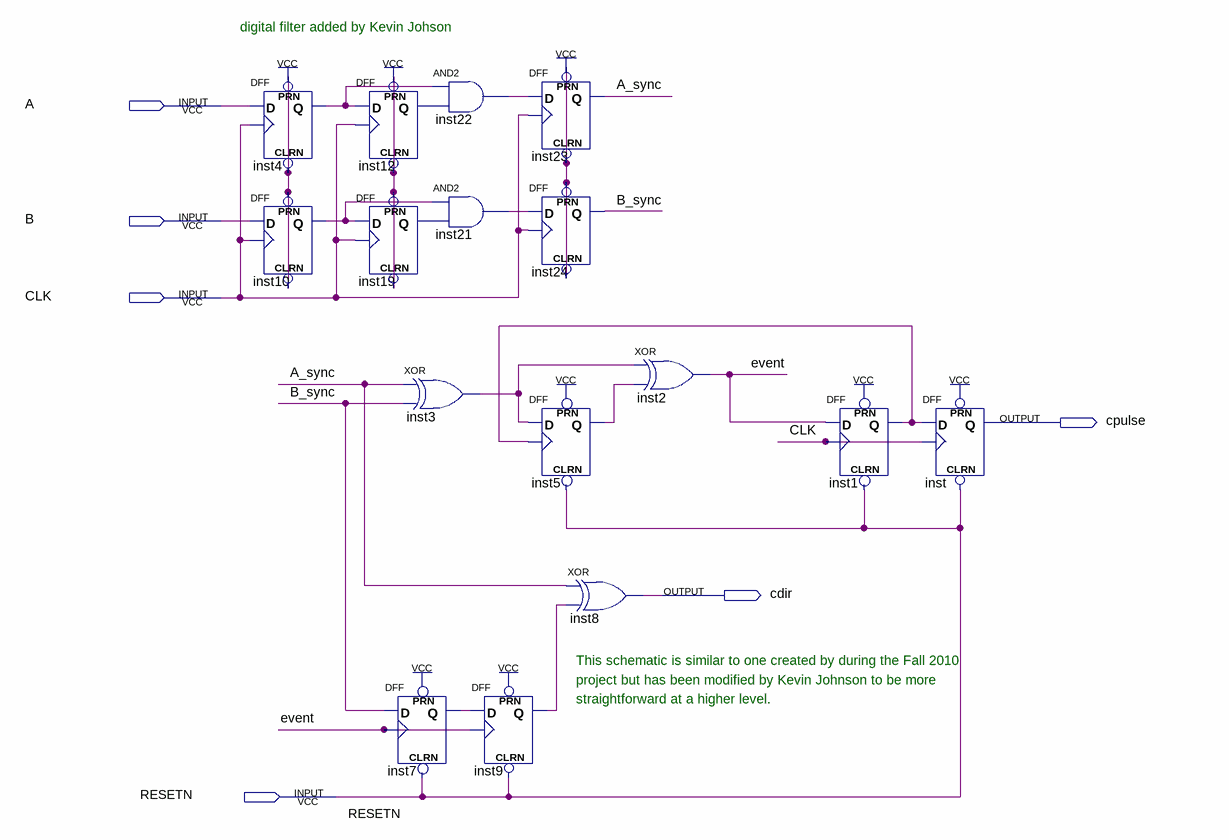
[diagram p0: schematic sheet]
// Quartus schematic QUADRATURE_DECODE.bdf as structural Verilog: 16 symbols, 6 pins
module QUADRATURE_DECODE (
  input  A,
  input  B,
  input  CLK,
  input  RESETN,
  output cpulse,
  output cdir
);

  wire A_sync, B_sync, \event , inst1_q, inst3_out, inst4_q, inst5_q, inst7_q, inst9_q, inst10_q, inst12_q,
       inst19_q, inst21_out, inst22_out;

  DFF inst4 (.CLRN(1'b1), .CLK(CLK), .D(A), .PRN(1'b1), .Q(inst4_q));
  DFF inst10 (.CLRN(1'b1), .CLK(CLK), .D(B), .PRN(1'b1), .Q(inst10_q));
  DFF inst12 (.CLRN(1'b1), .CLK(CLK), .D(inst4_q), .PRN(1'b1), .Q(inst12_q));
  DFF inst19 (.CLRN(1'b1), .CLK(CLK), .D(inst10_q), .PRN(1'b1), .Q(inst19_q));
  DFF inst7 (.CLRN(RESETN), .CLK(\event ), .D(B_sync), .PRN(1'b1), .Q(inst7_q));
  and inst22 (inst22_out, inst4_q, inst12_q);
  and inst21 (inst21_out, inst10_q, inst19_q);
  xor inst3 (inst3_out, A_sync, B_sync);
  DFF inst9 (.CLRN(RESETN), .CLK(\event ), .D(inst7_q), .PRN(1'b1), .Q(inst9_q));
  DFF inst23 (.CLRN(1'b1), .CLK(CLK), .D(inst22_out), .PRN(1'b1), .Q(A_sync));
  DFF inst24 (.CLRN(1'b1), .CLK(CLK), .D(inst21_out), .PRN(1'b1), .Q(B_sync));
  DFF inst5 (.CLRN(RESETN), .CLK(inst1_q), .D(inst3_out), .PRN(1'b1), .Q(inst5_q));
  xor inst8 (cdir, A_sync, inst9_q);
  xor inst2 (\event , inst3_out, inst5_q);
  DFF inst1 (.CLRN(RESETN), .CLK(CLK), .D(\event ), .PRN(1'b1), .Q(inst1_q));
  DFF inst (.CLRN(RESETN), .CLK(CLK), .D(inst1_q), .PRN(1'b1), .Q(cpulse));

  // Notes on the sheet:
  //   digital filter added by Kevin Johson
  //   This schematic is similar to one created by during the Fall 2010
  //   project but has been modified by Kevin Johnson to be more
  //   straightforward at a higher level.
endmodule
